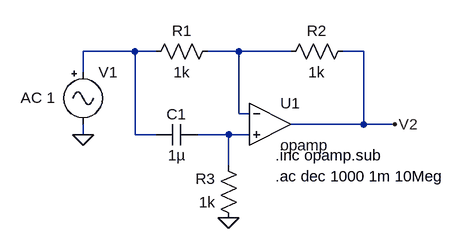
[diagram p0: schematic TS1.asc]
TS1.asc, the LTspice schematic file:
Version 4
SHEET 1 880 680
WIRE -16 80 -96 80
WIRE 16 80 -16 80
WIRE 144 80 96 80
WIRE 224 80 144 80
WIRE 336 80 304 80
WIRE -96 112 -96 80
WIRE 144 176 144 80
WIRE 160 176 144 176
WIRE 336 192 336 80
WIRE 336 192 224 192
WIRE 384 192 336 192
WIRE -96 208 -96 192
WIRE -16 208 -16 80
WIRE 16 208 -16 208
WIRE 128 208 80 208
WIRE 160 208 128 208
WIRE 128 256 128 208
FLAG 128 336 0
FLAG 384 192 V2
FLAG -96 208 0
SYMBOL OpAmps\\opamp 192 128 R0
SYMATTR InstName U1
SYMBOL res 112 64 R90
WINDOW 0 0 56 VBottom 2
WINDOW 3 32 56 VTop 2
SYMATTR InstName R1
SYMATTR Value 1k
SYMBOL res 320 64 R90
WINDOW 0 0 56 VBottom 2
WINDOW 3 32 56 VTop 2
SYMATTR InstName R2
SYMATTR Value 1k
SYMBOL res 144 352 R180
WINDOW 0 36 76 Left 2
WINDOW 3 36 40 Left 2
SYMATTR InstName R3
SYMATTR Value 1k
SYMBOL cap 80 192 R90
WINDOW 0 0 32 VBottom 2
WINDOW 3 32 32 VTop 2
SYMATTR InstName C1
SYMATTR Value 1µ
SYMBOL Misc\\signal -96 96 R0
WINDOW 123 -96 55 Left 2
WINDOW 39 0 0 Left 0
SYMATTR Value2 AC 1
SYMATTR InstName V1
SYMATTR Value ""
TEXT 200 240 Left 2 !.inc opamp.sub
TEXT 200 272 Left 2 !.ac dec 1000 1m 10Meg

The netlist it stands for:
* TS1.asc
XU1 N002 N003 V2 opamp Aol=100K GBW=10Meg  ; pins invin noninvin out
R1 N002 N001 1k
R2 V2 N002 1k
R3 0 N003 1k
C1 N003 N001 1µ
V1 N001 0 AC 1
.inc opamp.sub
.ac dec 1000 1m 10Meg
.backanno
.end